# EAGLE design KCVGA 1.1 (EAGLE 7.2.0)
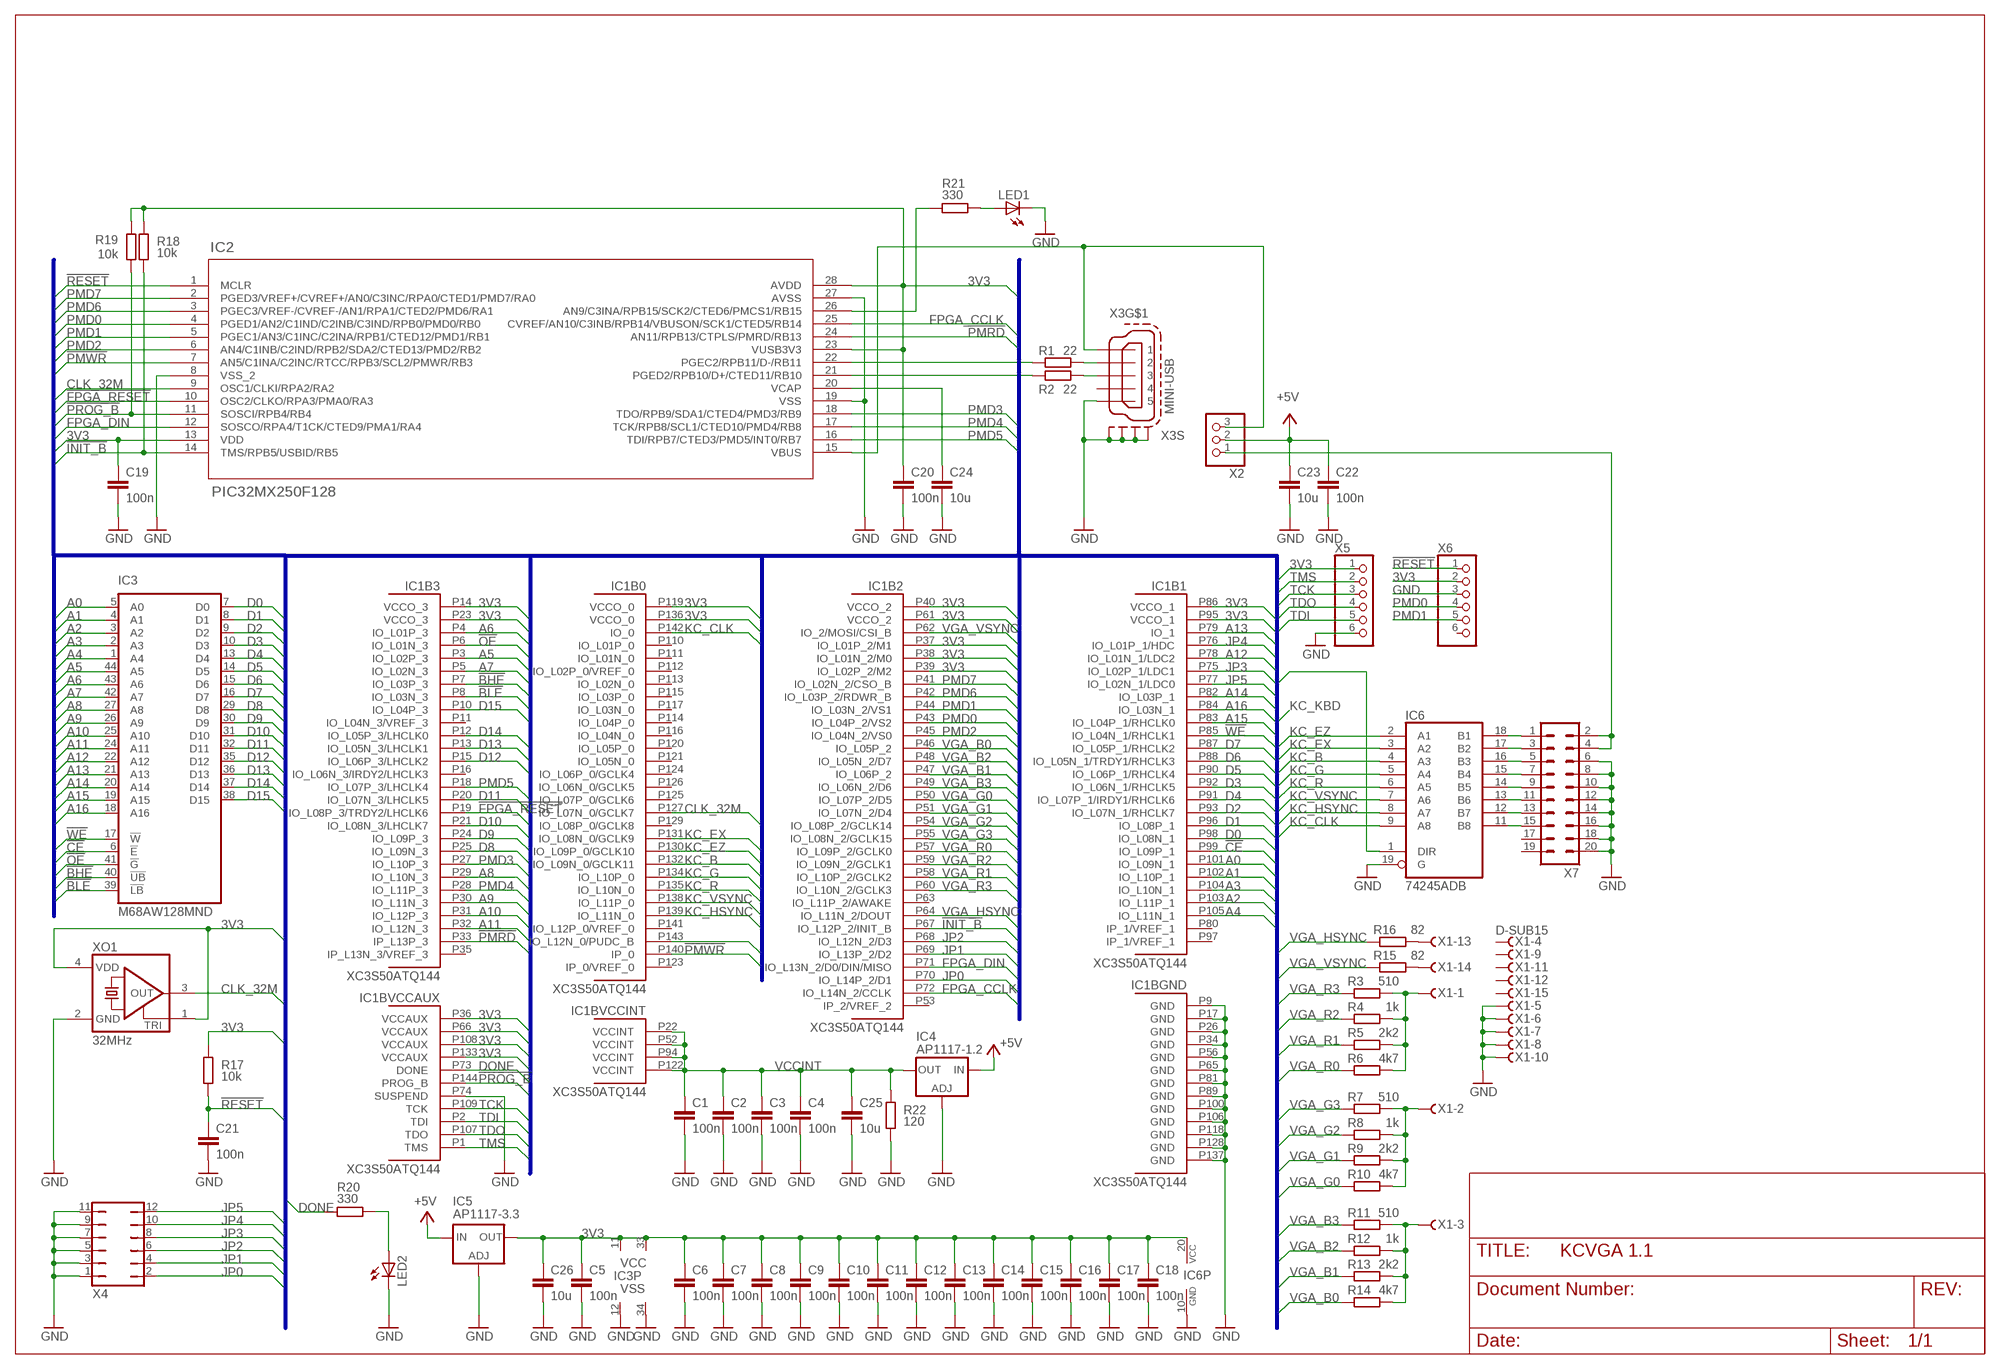
[diagram p0: schematic, sheet 1]

## Parts
C1  100n  C-EUC0603K  [C0603K]
C2  100n  C-EUC0603K  [C0603K]
C3  100n  C-EUC0603K  [C0603K]
C4  100n  C-EUC0603K  [C0603K]
C5  100n  C-EUC0603K  [C0603K]
C6  100n  C-EUC0603K  [C0603K]
C7  100n  C-EUC0603K  [C0603K]
C8  100n  C-EUC0603K  [C0603K]
C9  100n  C-EUC0603K  [C0603K]
C10  100n  C-EUC0603K  [C0603K]
C11  100n  C-EUC0603K  [C0603K]
C12  100n  C-EUC0603K  [C0603K]
C13  100n  C-EUC0603K  [C0603K]
C14  100n  C-EUC0603K  [C0603K]
C15  100n  C-EUC0603K  [C0603K]
C16  100n  C-EUC0603K  [C0603K]
C17  100n  C-EUC0603K  [C0603K]
C18  100n  C-EUC0603K  [C0603K]
C19  100n  C-EUC0603K  [C0603K]
C20  100n  C-EUC0603K  [C0603K]
C21  100n  C-EUC0603K  [C0603K]
C22  100n  C-EUC0603K  [C0603K]
C23  10u  C-EUC1206K  [C1206K]
C24  10u  C-EUC1206K  [C1206K]
C25  10u  C-EUC1206K  [C1206K]
C26  10u  C-EUC1206K  [C1206K]
IC1  XC3S50ATQ144  [TQ144]
IC2  PIC32MX250F128  PIC32MX250F128B_I_SS  [SSOP28_MC]
IC3  M68AW128MND  [TSOP44-II]
IC4  AP1117-1.2  LD117AS12TR  [SOT223]
IC5  AP1117-3.3  LD117AS33TR  [SOT223]
IC6  74245ADB  [SSOP20D8]
LED1  LEDCHIPLED_0603  [CHIPLED_0603]
LED2  LEDCHIPLED_0603  [CHIPLED_0603]
R1  22  R-EU_R0603  [R0603]
R2  22  R-EU_R0603  [R0603]
R3  510  R-EU_R0603  [R0603]
R4  1k  R-EU_R0603  [R0603]
R5  2k2  R-EU_R0603  [R0603]
R6  4k7  R-EU_R0603  [R0603]
R7  510  R-EU_R0603  [R0603]
R8  1k  R-EU_R0603  [R0603]
R9  2k2  R-EU_R0603  [R0603]
R10  4k7  R-EU_R0603  [R0603]
R11  510  R-EU_R0603  [R0603]
R12  1k  R-EU_R0603  [R0603]
R13  2k2  R-EU_R0603  [R0603]
R14  4k7  R-EU_R0603  [R0603]
R15  82  R-EU_R0603  [R0603]
R16  82  R-EU_R0603  [R0603]
R17  10k  R-EU_R0603  [R0603]
R18  10k  R-EU_R0603  [R0603]
R19  10k  R-EU_R0603  [R0603]
R20  330  R-EU_R0603  [R0603]
R21  330  R-EU_R0603  [R0603]
R22  120  R-EU_R0603  [R0603]
X1  D-SUB15  D-SUB15-HDR15RA  [HDR15RA]
X2  PINHD-1X3  [1X03]
X3  MINI-USB  MINI-USB-SCHIELD-32005-301  [32005-301]
X4  JP6Q  [JP6Q]
X5  PINHD-1X6  [1X06]
X6  PINHD-1X6  [1X06]
X7  ML20  [ML20]
XO1  32MHz  ASE  [ASE]

## Nets
3V3: C5.1 C6.1 C7.1 C8.1 C9.1 C10.1 C11.1 C12.1 C13.1 C14.1 C15.1 C16.1 C17.1 C18.1 C19.1 C20.1 C26.1 IC1.P14(B3:VCCO_3) IC1.P23(B3:VCCO_3) IC1.P36(BVCCAUX:VCCAUX) IC1.P37(B2:IO_L01P_2/M1) IC1.P38(B2:IO_L01N_2/M0) IC1.P39(B2:IO_L02P_2/M2) IC1.P40(B2:VCCO_2) IC1.P61(B2:VCCO_2) IC1.P66(BVCCAUX:VCCAUX) IC1.P86(B1:VCCO_1) IC1.P95(B1:VCCO_1) IC1.P108(BVCCAUX:VCCAUX) IC1.P119(B0:VCCO_0) IC1.P133(BVCCAUX:VCCAUX) IC1.P136(B0:VCCO_0) IC1.P143(B0:IO_L12N_0/PUDC_B) IC2.13(VDD) IC2.23(VUSB3V3) IC2.28(AVDD) IC3.11(VCC) IC3.33(VCC) IC5.4(OUT) IC6.1(DIR) IC6.20(VCC) R17.2 R18.2 R19.2 X5.1 X6.2 XO1.1(TRI) XO1.4(VDD)
!BHE: IC1.P7(B3:IO_L03P_3) IC3.40(!UB)
!BLE: IC1.P8(B3:IO_L03N_3) IC3.39(!LB)
!CE: IC1.P99(B1:IO_L09P_1) IC3.6(!E)
!FPGA_RESET: IC1.P19(B3:IO_L08P_3/TRDY2/LHCLK6) IC2.10(OSC2/CLKO/RPA3/PMA0/RA3)
!INIT_B: IC1.P67(B2:IO_L12P_2/INIT_B) IC2.14(TMS/RPB5/USBID/RB5) R18.1
!OE: IC1.P6(B3:IO_L01N_3) IC3.41(!G)
!PMRD: IC1.P33(B3:IP_L13P_3) IC2.24(AN11/RPB13/CTPLS/PMRD/RB13)
!PMWR: IC1.P140(B0:IP_0) IC2.7(AN5/C1INA/C2INC/RTCC/RPB3/SCL2/PMWR/RB3)
!PROG_B: IC1.P144(BVCCAUX:PROG_B) IC2.11(SOSCI/RPB4/RB4) R19.1
!RESET: C21.1 IC2.1(MCLR) R17.1 X6.1
!WE: IC1.P85(B1:IO_L04N_1/RHCLK1) IC3.17(!W)
+5V: C22.1 C23.1 IC4.3(IN) IC5.3(IN) X2.2
A0: IC1.P101(B1:IO_L09N_1) IC3.5(A0)
A1: IC1.P102(B1:IO_L10P_1) IC3.4(A1)
A2: IC1.P103(B1:IO_L11P_1) IC3.3(A2)
A3: IC1.P104(B1:IO_L10N_1) IC3.2(A3)
A4: IC1.P105(B1:IO_L11N_1) IC3.1(A4)
A5: IC1.P3(B3:IO_L02P_3) IC3.44(A5)
A6: IC1.P4(B3:IO_L01P_3) IC3.43(A6)
A7: IC1.P5(B3:IO_L02N_3) IC3.42(A7)
A8: IC1.P29(B3:IO_L10N_3) IC3.27(A8)
A9: IC1.P30(B3:IO_L11N_3) IC3.26(A9)
A10: IC1.P31(B3:IO_L12P_3) IC3.25(A10)
A11: IC1.P32(B3:IO_L12N_3) IC3.24(A11)
A12: IC1.P78(B1:IO_L01N_1/LDC2) IC3.22(A12)
A13: IC1.P79(B1:IO_1) IC3.21(A13)
A14: IC1.P82(B1:IO_L03P_1) IC3.20(A14)
A15: IC1.P83(B1:IO_L04P_1/RHCLK0) IC3.19(A15)
A16: IC1.P84(B1:IO_L03N_1) IC3.18(A16)
CLK_32M: IC1.P127(B0:IO_L07N_0/GCLK7) IC2.9(OSC1/CLKI/RPA2/RA2) XO1.3(OUT)
D0: IC1.P98(B1:IO_L08N_1) IC3.7(D0)
D1: IC1.P96(B1:IO_L08P_1) IC3.8(D1)
D2: IC1.P93(B1:IO_L07N_1/RHCLK7) IC3.9(D2)
D3: IC1.P92(B1:IO_L06N_1/RHCLK5) IC3.10(D3)
D4: IC1.P91(B1:IO_L07P_1/IRDY1/RHCLK6) IC3.13(D4)
D5: IC1.P90(B1:IO_L06P_1/RHCLK4) IC3.14(D5)
D6: IC1.P88(B1:IO_L05N_1/TRDY1/RHCLK3) IC3.15(D6)
D7: IC1.P87(B1:IO_L05P_1/RHCLK2) IC3.16(D7)
D8: IC1.P25(B3:IO_L09N_3) IC3.29(D8)
D9: IC1.P24(B3:IO_L09P_3) IC3.30(D9)
D10: IC1.P21(B3:IO_L08N_3/LHCLK7) IC3.31(D10)
D11: IC1.P20(B3:IO_L07N_3/LHCLK5) IC3.32(D11)
D12: IC1.P15(B3:IO_L06P_3/LHCLK2) IC3.35(D12)
D13: IC1.P13(B3:IO_L05N_3/LHCLK1) IC3.36(D13)
D14: IC1.P12(B3:IO_L05P_3/LHCLK0) IC3.37(D14)
D15: IC1.P10(B3:IO_L04P_3) IC3.38(D15)
DONE: IC1.P73(BVCCAUX:DONE) R20.1
FPGA_CCLK: IC1.P72(B2:IO_L14N_2/CCLK) IC2.25(CVREF/AN10/C3INB/RPB14/VBUSON/SCK1/CTED5/RB14)
FPGA_DIN: IC1.P71(B2:IO_L13N_2/D0/DIN/MISO) IC2.12(SOSCO/RPA4/T1CK/CTED9/PMA1/RA4)
GND: C1.2 C2.2 C3.2 C4.2 C5.2 C6.2 C7.2 C8.2 C9.2 C10.2 C11.2 C12.2 C13.2 C14.2 C15.2 C16.2 C17.2 C18.2 C19.2 C20.2 C21.2 C22.2 C23.2 C24.2 C25.2 C26.2 IC1.P9(BGND:GND) IC1.P17(BGND:GND) IC1.P26(BGND:GND) IC1.P34(BGND:GND) IC1.P56(BGND:GND) IC1.P65(BGND:GND) IC1.P74(BVCCAUX:SUSPEND) IC1.P81(BGND:GND) IC1.P89(BGND:GND) IC1.P100(BGND:GND) IC1.P106(BGND:GND) IC1.P118(BGND:GND) IC1.P128(BGND:GND) IC1.P137(BGND:GND) IC2.8(VSS_2) IC2.19(VSS) IC2.27(AVSS) IC3.12(VSS) IC3.34(VSS) IC4.1(ADJ) IC5.1(ADJ) IC6.10(GND) IC6.19(G) LED1.C LED2.C R22.1 X1.5 X1.6 X1.7 X1.8 X1.10 X3.5 X3.M1(S:S1) X3.M2(S:S2) X3.M3(S:S3) X3.M4(S:S4) X4.1 X4.3 X4.5 X4.7 X4.9 X4.11 X5.6 X6.3 X7.6 X7.8 X7.10 X7.12 X7.14 X7.16 X7.18 X7.20 XO1.2(GND)
JP0: IC1.P70(B2:IO_L14P_2/D1) X4.2
JP1: IC1.P69(B2:IO_L13P_2/D2) X4.4
JP2: IC1.P68(B2:IO_L12N_2/D3) X4.6
JP3: IC1.P75(B1:IO_L02P_1/LDC1) X4.8
JP4: IC1.P76(B1:IO_L01P_1/HDC) X4.10
JP5: IC1.P77(B1:IO_L02N_1/LDC0) X4.12
KC_B: IC1.P132(B0:IO_L09N_0/GCLK11) IC6.4(A3)
KC_CLK: IC1.P142(B0:IO_0) IC6.9(A8)
KC_EX: IC1.P131(B0:IO_L08N_0/GCLK9) IC6.3(A2)
KC_EZ: IC1.P130(B0:IO_L09P_0/GCLK10) IC6.2(A1)
KC_G: IC1.P134(B0:IO_L10P_0) IC6.5(A4)
KC_HSYNC: IC1.P139(B0:IO_L11N_0) IC6.8(A7)
KC_R: IC1.P135(B0:IO_L10N_0) IC6.6(A5)
KC_VSYNC: IC1.P138(B0:IO_L11P_0) IC6.7(A6)
N$1: IC2.15(VBUS) X2.3 X3.1
N$2: IC6.18(B1) X7.1
N$3: IC6.17(B2) X7.3
N$4: IC6.16(B3) X7.5
N$5: IC6.15(B4) X7.7
N$6: IC6.14(B5) X7.9
N$7: IC6.13(B6) X7.11
N$8: IC6.12(B7) X7.13
N$9: IC6.11(B8) X7.15
N$10: R16.2 X1.13
N$11: IC2.22(PGEC2/RPB11/D-/RB11) R1.1
N$12: IC2.21(PGED2/RPB10/D+/CTED11/RB10) R2.1
N$13: R1.2 X3.2
N$14: R2.2 X3.3
N$15: R15.2 X1.14
N$16: C24.1 IC2.20(VCAP)
N$17: R11.2 R12.2 R13.2 R14.2 X1.3
N$18: R7.2 R8.2 R9.2 R10.2 X1.2
N$19: R3.2 R4.2 R5.2 R6.2 X1.1
N$20: X2.1 X7.2 X7.4
N$21: LED2.A R20.2
N$22: IC2.26(AN9/C3INA/RPB15/SCK2/CTED6/PMCS1/RB15) R21.1
N$23: LED1.A R21.2
PMD0: IC1.P43(B2:IO_L04P_2/VS2) IC2.4(PGED1/AN2/C1IND/C2INB/C3IND/RPB0/PMD0/RB0) X6.4
PMD1: IC1.P44(B2:IO_L03N_2/VS1) IC2.5(PGEC1/AN3/C1INC/C2INA/RPB1/CTED12/PMD1/RB1) X6.5
PMD2: IC1.P45(B2:IO_L04N_2/VS0) IC2.6(AN4/C1INB/C2IND/RPB2/SDA2/CTED13/PMD2/RB2)
PMD3: IC1.P27(B3:IO_L10P_3) IC2.18(TDO/RPB9/SDA1/CTED4/PMD3/RB9)
PMD4: IC1.P28(B3:IO_L11P_3) IC2.17(TCK/RPB8/SCL1/CTED10/PMD4/RB8)
PMD5: IC1.P18(B3:IO_L07P_3/LHCLK4) IC2.16(TDI/RPB7/CTED3/PMD5/INT0/RB7)
PMD6: IC1.P42(B2:IO_L03P_2/RDWR_B) IC2.3(PGEC3/VREF-/CVREF-/AN1/RPA1/CTED2/PMD6/RA1)
PMD7: IC1.P41(B2:IO_L02N_2/CSO_B) IC2.2(PGED3/VREF+/CVREF+/AN0/C3INC/RPA0/CTED1/PMD7/RA0)
TCK: IC1.P109(BVCCAUX:TCK) X5.3
TDI: IC1.P2(BVCCAUX:TDI) X5.5
TDO: IC1.P107(BVCCAUX:TDO) X5.4
TMS: IC1.P1(BVCCAUX:TMS) X5.2
VCCINT: C1.1 C2.1 C3.1 C4.1 C25.1 IC1.P22(BVCCINT:VCCINT) IC1.P52(BVCCINT:VCCINT) IC1.P94(BVCCINT:VCCINT) IC1.P122(BVCCINT:VCCINT) IC4.4(OUT) R22.2
VGA_B0: IC1.P46(B2:IO_L05P_2) R14.1
VGA_B1: IC1.P47(B2:IO_L06P_2) R13.1
VGA_B2: IC1.P48(B2:IO_L05N_2/D7) R12.1
VGA_B3: IC1.P49(B2:IO_L06N_2/D6) R11.1
VGA_G0: IC1.P50(B2:IO_L07P_2/D5) R10.1
VGA_G1: IC1.P51(B2:IO_L07N_2/D4) R9.1
VGA_G2: IC1.P54(B2:IO_L08P_2/GCLK14) R8.1
VGA_G3: IC1.P55(B2:IO_L08N_2/GCLK15) R7.1
VGA_HSYNC: IC1.P64(B2:IO_L11N_2/DOUT) R16.1
VGA_R0: IC1.P57(B2:IO_L09P_2/GCLK0) R6.1
VGA_R1: IC1.P58(B2:IO_L10P_2/GCLK2) R5.1
VGA_R2: IC1.P59(B2:IO_L09N_2/GCLK1) R4.1
VGA_R3: IC1.P60(B2:IO_L10N_2/GCLK3) R3.1
VGA_VSYNC: IC1.P62(B2:IO_2/MOSI/CSI_B) R15.1
Unconnected: IC1.P11(B3:IO_L04N_3/VREF_3) IC1.P16(B3:IO_L06N_3/IRDY2/LHCLK3) IC1.P35(B3:IP_L13N_3/VREF_3) IC1.P53(B2:IP_2/VREF_2) IC1.P63(B2:IO_L11P_2/AWAKE) IC1.P80(B1:IP_1/VREF_1) IC1.P97(B1:IP_1/VREF_1) IC1.P110(B0:IO_L01P_0) IC1.P111(B0:IO_L01N_0) IC1.P112(B0:IO_L02P_0/VREF_0) IC1.P113(B0:IO_L02N_0) IC1.P114(B0:IO_L04P_0) IC1.P115(B0:IO_L03P_0) IC1.P116(B0:IO_L04N_0) IC1.P117(B0:IO_L03N_0) IC1.P120(B0:IO_L05P_0) IC1.P121(B0:IO_L05N_0) IC1.P123(B0:IP_0/VREF_0) IC1.P124(B0:IO_L06P_0/GCLK4) IC1.P125(B0:IO_L07P_0/GCLK6) IC1.P126(B0:IO_L06N_0/GCLK5) IC1.P129(B0:IO_L08P_0/GCLK8) IC1.P141(B0:IO_L12P_0/VREF_0) X1.4 X1.9 X1.11 X1.12 X1.15 X3.4 X6.6 X7.17 X7.19

## Buses
BUS:3V3,!WE,!CE,!OE,!BLE,!BHE,A[0..16],D[0..15],KC_CLK,KC_VSYNC,KC_HSYNC,KC_R,KC_G,KC_B,KC_EX,KC_EY,KC_EZ,VGA_HSYNC,VGA_VSYNC,VGA_R[0..3],VGA_G[0..3],VGA_B[0..3],PMD[0..7],PMA[0..1],!PMRD,!PMWR,TMS,TCK,TDO,TDI,CLK_32M,FPGA_CLK,!RESET,FPGA_CCLK,FPGA_DIN,!INIT_B,!PROG_B,DONE,!FPGA_RESET,JP[0..5]

## Library data of the parts
C1-C26 = rcl:C-EU: CAPACITOR, European symbol
IC1 = xilinx_devices_V6:XC3S50ATQ144: Xilinx FPGA: XC3S50ATQ144
IC2 = PIC32MX270:PIC32MX250F128B_I_SS
IC3 = st-microelectronics:M68AW128M: 2 Mbit (128K x16) 3.0V Asynchronous SRAM Source: Source: http://us.st.com/stonline/products/literature/ds/7995.pdf; OC_FARNELL: unknown; OC_NEWARK: unknown
IC4 IC5 = v-reg:LD117A?*: Low drop fixed and adjustable positive voltage regulators 1 A Source: http://www.st.com/stonline/products/literature/ds/7194/ld1117axx.pdf
IC6 = 74xx-eu:74*245: Octal BUS TRANSCEIVER, 3-state
LED1 LED2 = led:LED: LED OSRAM: - CHIPLED LG R971, LG N971, LY N971, LG Q971, LY Q971, LO R971, LY R971 LH N974, LH R974 LS Q976, LO Q976, LY Q976 LO Q996 - Hyper CHIPLED LW Q18S LB Q993, LB Q99A, LB R99A - SideLED LS A670, LO A670, LY A670, LG A670, LP A670 LB A673, LV A673, LT A673, LW A673 LH A674 LY A675 LS A676, LA A676, LO A676, LY A676, LW A676 LS A679, LY A679, LG A679 - Hyper Micro SIDELED® LS Y876, LA Y876, LO Y876, LY Y876 LT Y87S - SmartLED LW L88C, LW L88S LB L89C, LB L89S, LG L890 LS L89K, LO L89K, LY L89K LS L896, LA L896, LO L896, LY L896 - TOPLED LS T670, LO T670, LY T670, LG T670, LP T670 LSG T670, LSP T670, LSY T670, LOP T670, LYG T670 LG T671, LOG T671, LSG T671 LB T673, LV T673, LT T673, LW T673 LH T674 LS T676, LA T676, LO T676, LY T676, LB T676, LH T676, LSB T676, LW T676 LB T67C, LV T67C, LT T67C, LS T67K, LO T67K, LY T67K, LW E67C LS E67B, LA E67B, LO E67B, LY E67B, LB E67C, LV E67C, LT E67C LW T67C LS T679, LY T679, LG T679 LS T770, LO T770, LY T770, LG T770, LP T770 LB T773, LV T773, LT T773, LW T773 LH T774 LS E675, LA E675, LY E675, LS T675 LS T776, LA T776, LO T776, LY T776, LB T776 LHGB T686 LT T68C, LB T68C - Hyper Mini TOPLED® LB M676 - Mini TOPLED Santana® LG M470 LS M47K, LO M47K, LY M47K Source: http://www.osram.convergy.de LUXEON: - LUMILED® LXK2-PW12-R00, LXK2-PW12-S00, LXK2-PW14-U00, LXK2-PW14-V00 LXK2-PM12-R00, LXK2-PM12-S00, LXK2-PM14-U00 LXK2-PE12-Q00, LXK2-PE12-R00, LXK2-PE12-S00, LXK2-PE14-T00, LXK2-PE14-U00 LXK2-PB12-K00, LXK2-PB12-L00, LXK2-PB12-M00, LXK2-PB14-N00, LXK2-PB14-P00, LXK2-PB14-Q00 LXK2-PR12-L00, LXK2-PR12-M00, LXK2-PR14-Q00, LXK2-PR14-R00 LXK2-PD12-Q00, LXK2-PD12-R00, LXK2-PD12-S00 LXK2-PH12-R00, LXK2-PH12-S00 LXK2-PL12-P00, LXK2-PL12-Q00, LXK2-PL12-R00 Source: www.luxeon.com KINGBRIGHT: KA-3528ASYC Source: www.kingbright.com
R1-R22 = rcl:R-EU_: RESISTOR, European symbol
X1 = con-thomas-betts:D-SUB15-: D-Subminiatur Connector Source: Electronioc Interconnects European Edition 1998; OC_FARNELL: unknown; OC_NEWARK: unknown
X2 = pinhead:PINHD-1X3: PIN HEADER
X3 = con-cypressindustries:MINI-USB-SCHIELD-: MINI USB-B Conector Source: www.cypressindustries.com; OC_FARNELL: unknown; OC_NEWARK: unknown
X4 = jumper:JP6Q: JUMPER
X5 X6 = pinhead:PINHD-1X6: PIN HEADER
X7 = con-ml:ML20: HARTING; OC_FARNELL: unknown; OC_NEWARK: unknown
XO1 = crystal:ASE: 3.3Vdc CMOS SMD CRYSTAL CLOCK OSCILLATOR SOurce: www.abracon.com; OC_FARNELL: unknown; OC_NEWARK: unknown; RS: 671-9750

## Board
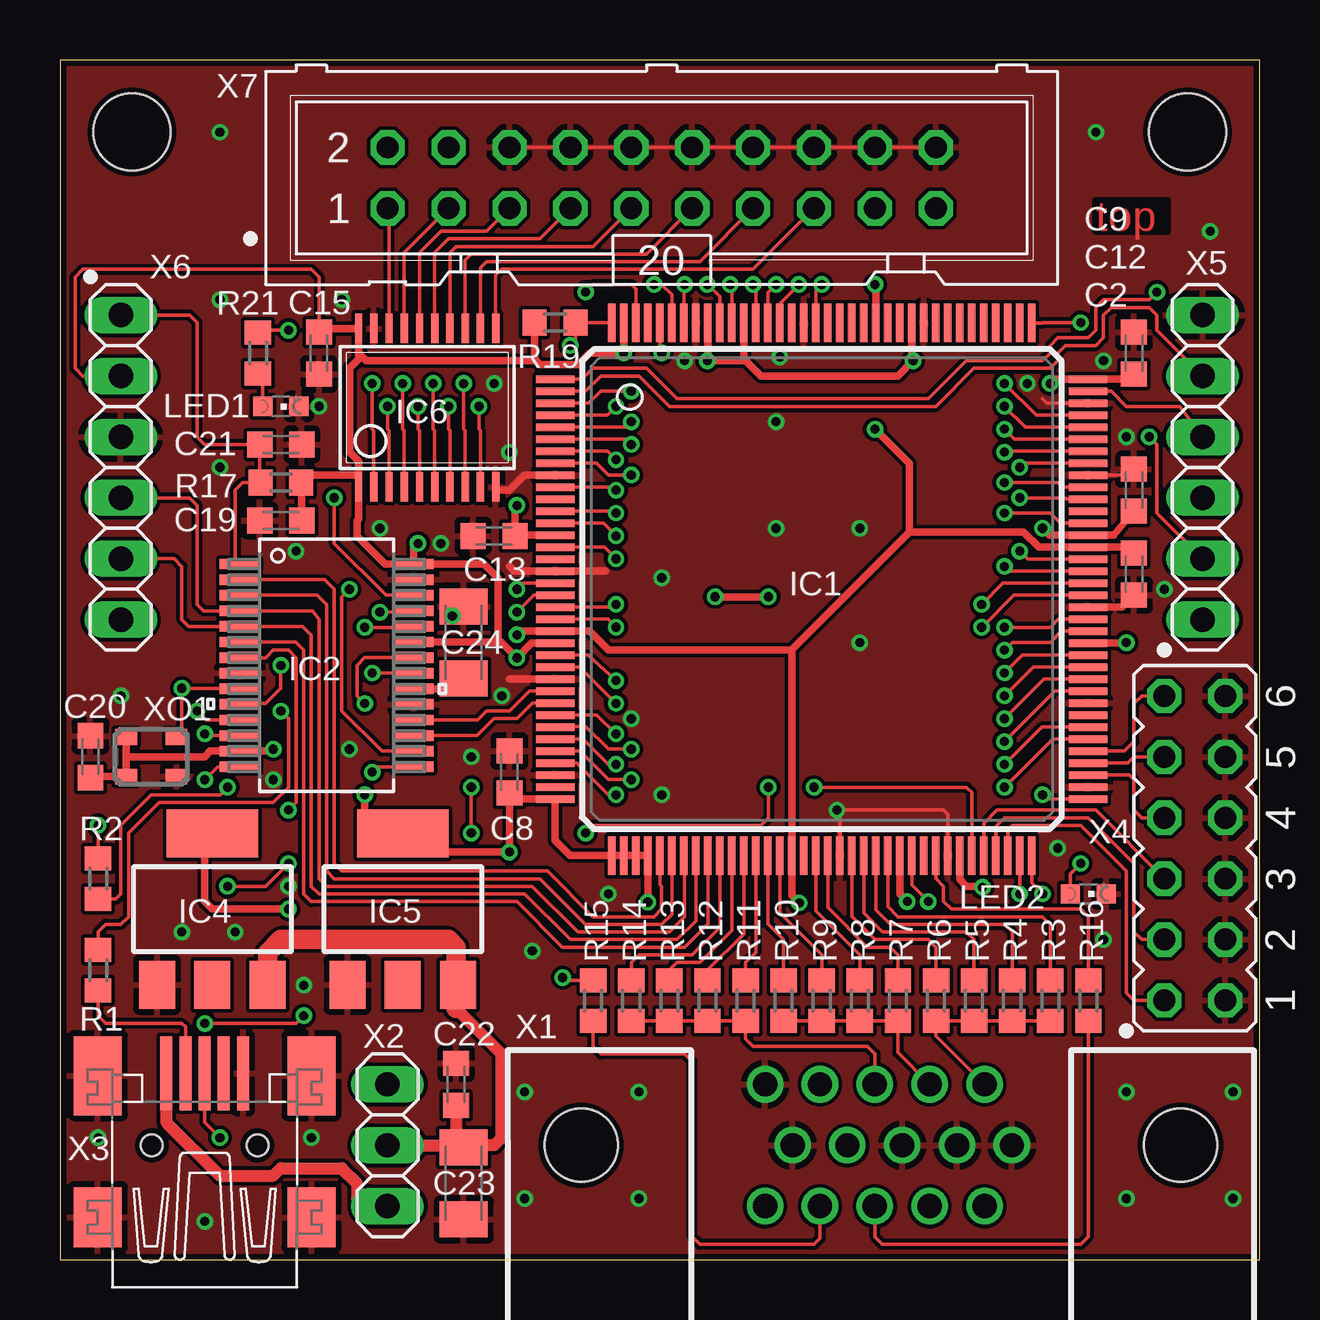
[diagram p1: board, top side]
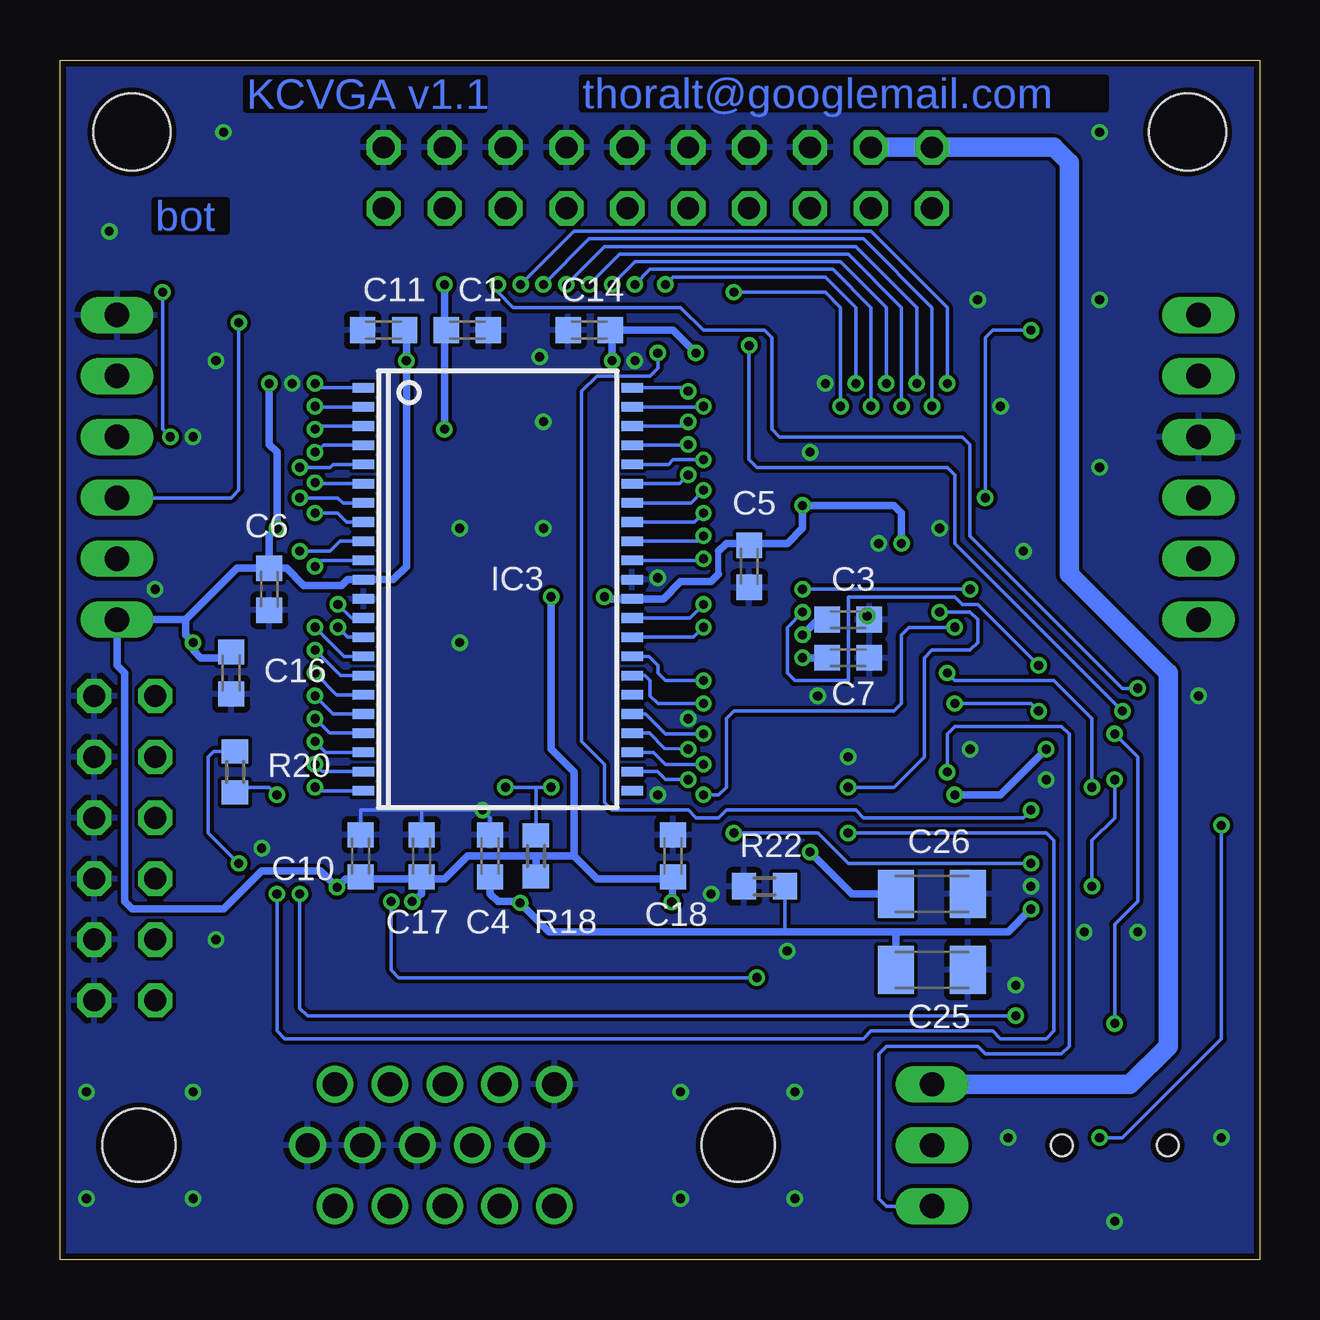
[diagram p2: board, bottom side, seen from below]

Size 50 x 50 mm. Coordinates in mm from the lower left corner, seen from the top.
Outline: 0,0 50,0 50,50 0,50 0,0
Copper layers (1*16): Top 0.035mm / dielectric 1.5mm / Bottom 0.035mm
Design rules "SeeedStudio_2layer_DRU_no_angle_20140221": minimum track width 6mil, minimum drill 12mil, track to track 6mil, track to pad 6mil, pad to pad 6mil, via to via 6mil, smd to smd 0mil, copper to edge 10mil, drill to drill 10mil, minimum pad ring 10mil, minimum via ring 6mil, stop-mask expansion 2mil, vias tented up to drill 100mil, thermal gap 10mil
Holes 3.2 mm at 3,47 47,47

### Footprints (pad centres in the part's own frame; a part is rotated, then mirrored left to right if it is on the bottom)
C0603K = smd 1.05 x 1.08: 1 -0.875,0; 2 0.875,0
C1206K = smd 1.5 x 2: 1 -1.5,0; 2 1.5,0
TQ144 = smd 1.6 x 0.3: P1 -11.1,8.75; P2 -11.1,8.25; P3 -11.1,7.75; P4 -11.1,7.25; P5 -11.1,6.75; P6 -11.1,6.25; P7 -11.1,5.75; P8 -11.1,5.25; P9 -11.1,4.75; P10 -11.1,4.25; P11 -11.1,3.75; P12 -11.1,3.25; P13 -11.1,2.75; P14 -11.1,2.25; P15 -11.1,1.75; P16 -11.1,1.25; P17 -11.1,0.75; P18 -11.1,0.25; P19 -11.1,-0.25; P20 -11.1,-0.75; P21 -11.1,-1.25; P22 -11.1,-1.75; P23 -11.1,-2.25; P24 -11.1,-2.75; P25 -11.1,-3.25; P26 -11.1,-3.75; P27 -11.1,-4.25; P28 -11.1,-4.75; P29 -11.1,-5.25; P30 -11.1,-5.75; P31 -11.1,-6.25; P32 -11.1,-6.75; P33 -11.1,-7.25; P34 -11.1,-7.75; P35 -11.1,-8.25; P36 -11.1,-8.75; P73 11.1,-8.75; P74 11.1,-8.25; P75 11.1,-7.75; P76 11.1,-7.25; P77 11.1,-6.75; P78 11.1,-6.25; P79 11.1,-5.75; P80 11.1,-5.25; P81 11.1,-4.75; P82 11.1,-4.25; P83 11.1,-3.75; P84 11.1,-3.25; P85 11.1,-2.75; P86 11.1,-2.25; P87 11.1,-1.75; P88 11.1,-1.25; P89 11.1,-0.75; P90 11.1,-0.25; P91 11.1,0.25; P92 11.1,0.75; P93 11.1,1.25; P94 11.1,1.75; P95 11.1,2.25; P96 11.1,2.75; P97 11.1,3.25; P98 11.1,3.75; P99 11.1,4.25; P100 11.1,4.75; P101 11.1,5.25; P102 11.1,5.75; P103 11.1,6.25; P104 11.1,6.75; P105 11.1,7.25; P106 11.1,7.75; P107 11.1,8.25; P108 11.1,8.75 | smd 0.3 x 1.6: P37 -8.75,-11.1; P38 -8.25,-11.1; P39 -7.75,-11.1; P40 -7.25,-11.1; P41 -6.75,-11.1; P42 -6.25,-11.1; P43 -5.75,-11.1; P44 -5.25,-11.1; P45 -4.75,-11.1; P46 -4.25,-11.1; P47 -3.75,-11.1; P48 -3.25,-11.1; P49 -2.75,-11.1; P50 -2.25,-11.1; P51 -1.75,-11.1; P52 -1.25,-11.1; P53 -0.75,-11.1; P54 -0.25,-11.1; P55 0.25,-11.1; P56 0.75,-11.1; P57 1.25,-11.1; P58 1.75,-11.1; P59 2.25,-11.1; P60 2.75,-11.1; P61 3.25,-11.1; P62 3.75,-11.1; P63 4.25,-11.1; P64 4.75,-11.1; P65 5.25,-11.1; P66 5.75,-11.1; P67 6.25,-11.1; P68 6.75,-11.1; P69 7.25,-11.1; P70 7.75,-11.1; P71 8.25,-11.1; P72 8.75,-11.1; P109 8.75,11.1; P110 8.25,11.1; P111 7.75,11.1; P112 7.25,11.1; P113 6.75,11.1; P114 6.25,11.1; P115 5.75,11.1; P116 5.25,11.1; P117 4.75,11.1; P118 4.25,11.1; P119 3.75,11.1; P120 3.25,11.1; P121 2.75,11.1; P122 2.25,11.1; P123 1.75,11.1; P124 1.25,11.1; P125 0.75,11.1; P126 0.25,11.1; P127 -0.25,11.1; P128 -0.75,11.1; P129 -1.25,11.1; P130 -1.75,11.1; P131 -2.25,11.1; P132 -2.75,11.1; P133 -3.25,11.1; P134 -3.75,11.1; P135 -4.25,11.1; P136 -4.75,11.1; P137 -5.25,11.1; P138 -5.75,11.1; P139 -6.25,11.1; P140 -6.75,11.1; P141 -7.25,11.1; P142 -7.75,11.1; P143 -8.25,11.1; P144 -8.75,11.1
SSOP28_MC = smd 1.676 x 0.432: 1 -3.617,4.225; 2 -3.617,3.575; 3 -3.617,2.925; 4 -3.617,2.275; 5 -3.617,1.625; 6 -3.617,0.975; 7 -3.617,0.325; 8 -3.617,-0.325; 9 -3.617,-0.975; 10 -3.617,-1.625; 11 -3.617,-2.275; 12 -3.617,-2.925; 13 -3.617,-3.575; 14 -3.617,-4.225; 15 3.617,-4.225; 16 3.617,-3.575; 17 3.617,-2.925; 18 3.617,-2.275; 19 3.617,-1.625; 20 3.617,-0.975; 21 3.617,-0.325; 22 3.617,0.325; 23 3.617,0.975; 24 3.617,1.625; 25 3.617,2.275; 26 3.617,2.925; 27 3.617,3.575; 28 3.617,4.225
TSOP44-II = smd 0.4 x 0.9: 1 -8.4,-5.6; 2 -7.6,-5.6; 3 -6.8,-5.6; 4 -6,-5.6; 5 -5.2,-5.6; 6 -4.4,-5.6; 7 -3.6,-5.6; 8 -2.8,-5.6; 9 -2,-5.6; 10 -1.2,-5.6; 11 -0.4,-5.6; 12 0.4,-5.6; 13 1.2,-5.6; 14 2,-5.6; 15 2.8,-5.6; 16 3.6,-5.6; 17 4.4,-5.6; 18 5.2,-5.6; 19 6,-5.6; 20 6.8,-5.6; 21 7.6,-5.6; 22 8.4,-5.6; 23 8.4,5.6; 24 7.6,5.6; 25 6.8,5.6; 26 6,5.6; 27 5.2,5.6; 28 4.4,5.6; 29 3.6,5.6; 30 2.8,5.6; 31 2,5.6; 32 1.2,5.6; 33 0.4,5.6; 34 -0.4,5.6; 35 -1.2,5.6; 36 -2,5.6; 37 -2.8,5.6; 38 -3.6,5.6; 39 -4.4,5.6; 40 -5.2,5.6; 41 -6,5.6; 42 -6.8,5.6; 43 -7.6,5.6; 44 -8.4,5.6
SOT223 = smd 1.5 x 2: 1 -2.3,-3.15; 2 0,-3.15; 3 2.3,-3.15 | smd 3.8 x 2: 4 0,3.15
SSOP20D8 = smd 0.305 x 1.245: 1 -2.794,-3.353; 2 -2.159,-3.353; 3 -1.524,-3.353; 4 -0.889,-3.353; 5 -0.254,-3.353; 6 0.381,-3.353; 7 1.016,-3.353; 8 1.651,-3.353; 9 2.286,-3.353; 10 2.921,-3.353; 11 2.921,3.251; 12 2.286,3.251; 13 1.651,3.251; 14 1.016,3.251; 15 0.381,3.251; 16 -0.254,3.251; 17 -0.889,3.251; 18 -1.524,3.251; 19 -2.159,3.251; 20 -2.794,3.251
CHIPLED_0603 = smd 0.8 x 0.8: A 0,-0.75; C 0,0.75
R0603 = smd 1 x 1.1: 1 -0.85,0; 2 0.85,0
HDR15RA = drill 1.016: 1 4.318,2.54; 2 2.032,2.54; 3 -0.254,2.54; 4 -2.54,2.54; 5 -4.826,2.54; 6 5.461,0; 7 3.175,0; 8 0.889,0; 9 -1.397,0; 10 -3.683,0; 11 4.318,-2.54; 12 2.032,-2.54; 13 -0.254,-2.54; 14 -2.54,-2.54; 15 -4.826,-2.54 | hole 3.048: -12.497,0; 12.497,0
1X03 = drill 1.016 long: 1 -2.54,0; 2 0,0; 3 2.54,0
32005-301 = smd 3.1 x 0.5: 1 3,1.6; 2 3,0.8; 3 3,0; 4 3,-0.8; 5 3,-1.6 | smd 2.5 x 2: M1 -3,-4.45; M2 -3,4.45 | smd 3.3 x 2: M3 2.9,4.45; M4 2.9,-4.45 | hole 0.9: 0,2.2; 0,-2.2
JP6Q = drill 0.914 octagon: 1 -6.35,-1.27; 2 -6.35,1.27; 3 -3.81,-1.27; 4 -3.81,1.27; 5 -1.27,-1.27; 6 -1.27,1.27; 7 1.27,-1.27; 8 1.27,1.27; 9 3.81,-1.27; 10 3.81,1.27; 11 6.35,-1.27; 12 6.35,1.27
1X06 = drill 1.016 long: 1 -6.35,0; 2 -3.81,0; 3 -1.27,0; 4 1.27,0; 5 3.81,0; 6 6.35,0
ML20 = drill 0.914 octagon: 1 -11.43,-1.27; 2 -11.43,1.27; 3 -8.89,-1.27; 4 -8.89,1.27; 5 -6.35,-1.27; 6 -6.35,1.27; 7 -3.81,-1.27; 8 -3.81,1.27; 9 -1.27,-1.27; 10 -1.27,1.27; 11 1.27,-1.27; 12 1.27,1.27; 13 3.81,-1.27; 14 3.81,1.27; 15 6.35,-1.27; 16 6.35,1.27; 17 8.89,-1.27; 18 8.89,1.27; 19 11.43,-1.27; 20 11.43,1.27
ASE = smd 0.9 x 0.65: 1 -1.05,-0.825; 2 1.05,-0.825; 3 1.05,0.825; 4 -1.05,0.825

### Placement (x,y rotation side)
C1  33.02,38.73 0 bottom
C2  44.77,28.57 270 top
C3  17.14,26.67 0 bottom
C4  32.07,16.83 90 bottom
C5  21.27,28.89 270 bottom
C6  41.27,27.94 270 bottom
C7  17.14,25.08 0 bottom
C8  18.73,20.32 90 top
C9  44.77,37.78 90 top
C10  37.47,16.83 90 bottom
C11  36.51,38.73 180 bottom
C12  44.77,32.07 90 top
C13  18.1,30.16 180 top
C14  27.94,38.73 180 bottom
C15  10.79,37.78 270 top
C16  42.86,24.45 270 bottom
C17  34.92,16.83 90 bottom
C18  24.45,16.83 90 bottom
C19  9.21,30.8 180 top
C20  1.27,20.95 90 top
C21  9.21,33.97 0 top
C22  16.51,7.3 90 top
C23  16.83,3.17 270 top
C24  16.83,25.72 90 top
C25  13.65,12.06 0 bottom
C26  13.65,15.24 0 bottom
IC1  31.75,27.94 0 top
IC2  11.11,24.77 0 top
IC3  31.75,27.94 270 bottom
IC4  6.35,14.61 0 top
IC5  14.29,14.61 0 top
IC6  15.24,35.56 0 top
LED1  9.21,35.56 270 top
LED2  42.86,15.24 270 top
R1  1.59,12.06 270 top
R2  1.59,15.88 90 top
R3  41.27,10.79 270 top
R4  39.69,10.79 270 top
R5  38.1,10.79 270 top
R6  36.51,10.79 270 top
R7  34.92,10.79 270 top
R8  33.34,10.79 270 top
R9  31.75,10.79 270 top
R10  30.16,10.79 270 top
R11  28.57,10.79 270 top
R12  26.99,10.79 270 top
R13  25.4,10.79 270 top
R14  23.81,10.79 270 top
R15  22.23,10.79 270 top
R16  42.86,10.79 270 top
R17  9.21,32.38 0 top
R18  30.16,16.83 270 bottom
R19  20.64,39.05 180 top
R20  42.7,20.32 90 bottom
R21  8.26,37.78 270 top
R22  20.64,15.56 0 bottom
X1  34.22,4.76 0 top
X2  13.65,4.76 270 top
X3  6.03,4.76 90 top
X4  47.31,17.14 90 top
X5  47.62,33.02 90 top
X6  2.54,33.02 270 top
X7  25.08,45.09 0 top
XO1  3.81,20.95 0 top

### Tracks (layer width: path | path; a pad name or v marks a point on that pad's centre or on a via)
3V3  (via drill 0.38)
  Top 0.152: v27,37.48 v26.99,37.47 | 35.5,37.52 v35.56,37.47 | 44.7,36.69 C9.1 | 38.42,15.56 v38.45,15.52 | 18.99,19.19 C8.1 | 19,30.19 C13.1 | 2.76,20.86 2.86,20.95 | 1.32,20.13 C20.1 | 20.64,19.18 IC1.P36 | X6.2 0.95,36.83 0.64,37.15 0.64,40.96 0.95,41.27 10.48,41.27 10.79,40.96 C15.1
  Top 0.305: IC1.P136 v27,37.48 | IC1.P119 35.5,37.52 | 44.7,36.69 IC1.P108 41.45,36.69 v41.27,36.51 | C12.1 43.92,30.19 IC1.P95 41.25,30.19 v40.96,30.48 | IC1.P66 37.5,15.84 37.78,15.56 38.42,15.56 | v24.5,14.9 IC1.P40 IC1.P39 IC1.P38 IC1.P37 21.26,16.84 20.64,17.46 20.64,19.18 | IC1.P36 18.99,19.19 | IC1.P14 19,30.19 | IC1.P61 35,15.24 v35.32,14.92 | XO1.4 2.76,20.86 XO1.1 1.32,20.13 | 2.86,20.95 6.03,20.95 6.27,21.19 IC2.13 8.81,21.19 v8.89,21.27 | IC2.28 13.55,28.99 12.38,30.16 12.38,30.8 12.45,30.86 IC6.1 12.45,32.7 | 19.05,30.09 C13.1 18.97,31.36 v19.05,31.43 | IC2.28 14.73,29.65 v14.92,29.84 | 10.72,38.73 C15.1 10.95,38.81 IC6.20 12.45,37.78 | R17.2 10.08,32.36 C19.1 10.08,32.62 10.16,32.7 12.45,32.7 | IC1.P23 19.66,25.69 v19.05,25.08 18.39,25.74 18.26,25.74 | 12.45,32.7 12.45,33.27 12.06,33.66 12.06,37.15 12.45,37.53 12.45,37.78 | v26.99,37.47 28.57,37.47 | 28.57,37.47 29.21,36.83 34.92,36.83 v35.56,37.47 | IC1.P133 28.5,37.54 28.57,37.47 | 19.84,37.47 20,37.31 21.59,37.31 22.07,37.78 v23.5,37.78 v23.5,37.79 IC1.P143 | R19.2 19.79,37.57 19.84,37.47 | 19.84,37.47 12.76,37.47 12.45,37.78 | C8.1 v18.73,16.99 15.06,16.99 IC5.4 12.72,17.75 12.7,17.78 v12.7,19.37 | IC2.23 18.26,25.74 | IC2.28 17.68,28.99 18.26,28.42 18.26,25.74 | v29.53,27.62 v27.3,27.62 | IC1.P86 44.42,25.69 v44.45,25.72
  Bottom 0.152: 26.99,38.49 C14.1 | 35.56,38.66 C11.1 | 35,15.88 C17.1
  Bottom 0.254: 22.54,28.57 22.54,29.53
  Bottom 0.305: v26.99,37.47 26.99,38.49 | 35.56,38.66 v35.56,37.47 35.56,28.89 36.11,28.34 IC3.11 38.02,28.34 38.26,28.1 39.85,28.1 40.56,28.82 C6.1 | v35.32,14.92 34.92,15.24 C17.1 34.61,15.88 33.97,15.88 33.02,16.83 30.16,16.83 | 37.47,15.88 C10.1 | v24.5,14.9 C18.1 24.45,15.88 27.62,15.88 28.57,16.83 | v14.92,29.84 14.92,31.11 15.24,31.43 v19.05,31.43 19.05,30.48 19.68,29.84 21.2,29.84 C5.1 21.35,29.84 22.23,29.84 22.54,29.53 | v19.05,25.08 C7.1 | 37.47,15.88 35,15.88 | IC3.33 24.85,27.54 24.13,28.26 22.86,28.26 22.54,28.57 | C6.1 42.62,28.82 44.77,26.67 | C6.1 41.27,30.16 v40.96,30.48 40.96,33.66 41.27,33.97 v41.27,36.51 | v23.5,37.78 24.45,38.73 C14.1 | 37.47,15.88 38.09,15.88 v38.45,15.52 39.13,16.19 41.59,16.19 43.18,14.61 46.99,14.61 47.31,14.92 47.31,24.45 47.62,24.77 X5.1 44.77,26.67 | 28.57,16.83 30.16,16.83 | v29.53,27.62 29.53,21.27 28.57,20.32 28.57,16.83 | v27.3,27.62 27.03,27.53 26.3,27.54 | v12.7,19.37 10.79,19.37 v8.89,21.27 | C26.1 16.99,15.24 v18.73,16.99 | R18.2 30.16,16.83 | C16.1 43.1,25.08 44.13,25.08 44.45,25.4 v44.45,25.72 44.77,26.04 44.77,26.67
!BHE  (via drill 0.38)
  Top 0.152: IC1.P7 22.82,33.69 v23.18,33.34
  Bottom 0.152: v23.18,33.34 24.45,33.34 24.64,33.14 IC3.40
!BLE  (via drill 0.38)
  Top 0.152: IC1.P8 22.37,33.19 22.86,32.7 v23.81,32.7
  Bottom 0.152: v23.81,32.7 24.18,32.34 IC3.39
!CE  (via drill 0.38)
  Top 0.152: IC1.P99 41.79,32.19 41.59,32.38 v39.37,32.38
  Bottom 0.152: IC3.6 39.33,32.34 v39.37,32.38
!FPGA_RESET  (via drill 0.38)
  Top 0.152: IC1.P19 19.75,27.69 v19.05,26.99 | v9.21,24.77 9.21,23.81 8.57,23.18 7.53,23.18 IC2.10
  Bottom 0.152: v9.21,24.77 11.75,27.3 12.38,27.3 12.7,27.62 17.14,27.62 17.14,24.13 19.37,24.13 19.68,24.45 19.68,26.35 v19.05,26.99
!INIT_B  (via drill 0.38)
  Top 0.152: IC1.P67 38,19.47 37.78,19.68 v31.43,19.68 | v29.53,19.68 29.53,18.41 29.21,18.1 22.23,18.1 v21.91,17.78 | v9.53,16.51 8.57,15.56 v6.99,15.56 | IC2.14 6.57,20.54 v6.03,20
  Bottom 0.152: v31.43,19.68 30.16,19.68 | 30.16,19.68 v29.53,19.68 | v21.91,17.78 18.41,17.78 17.14,16.51 v9.53,16.51 | v6.99,15.56 6.99,17.46 6.03,18.41 v6.03,20 | R18.1 30.16,19.68
!OE  (via drill 0.38)
  Top 0.152: IC1.P6 23.59,34.19 v23.81,33.97
  Bottom 0.152: IC3.41 24.16,33.94 v23.81,33.97
!PMRD  (via drill 0.38)
  Top 0.152: IC1.P33 21.54,20.69 22.86,19.37 v23.18,19.37 | v12.7,26.35 14.69,26.35 IC2.24
  Bottom 0.152: v23.18,19.37 22.54,19.37 22.23,19.68 22.23,22.54 21.91,22.86 15.24,22.86 14.92,23.18 14.92,26.04 14.61,26.35 v12.7,26.35
!PMWR  (via drill 0.38)
  Top 0.152: IC1.P140 25,37.87 v25.08,37.78 | v9.53,18.73 9.84,19.05 9.84,25.08 9.53,25.4 8.89,25.4 8.57,25.08 IC2.7
  Bottom 0.152: v25.08,37.78 25.08,37.15 25.4,36.83 27.62,36.83 28.26,36.2 28.26,21.59 27.3,20.64 27.3,19.05 26.99,18.73 23.81,18.73 23.5,18.41 22.54,18.41 22.23,18.73 16.83,18.73 16.51,18.41 9.84,18.41 v9.53,18.73
!PROG_B  (via drill 0.38)
  Top 0.152: IC1.P144 22.99,39.05 R19.1 21.49,38.31 v21.27,38.1 | IC2.11 6.08,22.49 v5.71,22.86
  Bottom 0.152: v5.71,22.86 12.7,29.84 12.7,32.7 13.02,33.02 20.95,33.02 21.27,33.34 v21.27,38.1
!RESET
  Top 0.152: IC2.1 7.3,29.18 7.3,32.07 7.62,32.38 R17.1 8.33,32.41 C21.1 6.03,33.97 5.71,34.29 5.71,39.05 5.4,39.37 X6.1
!WE  (via drill 0.38)
  Top 0.152: IC1.P85 40.11,25.19 v39.37,24.45
  Bottom 0.152: IC3.17 38.46,23.54 v39.37,24.45
+5V
  Top 0.152: 16.51,4.99 C23.1 16.91,4.76
  Top 0.508: X2.2 16.91,4.76 18.1,4.76 18.41,5.08 18.41,8.57 16.51,10.48 | C22.1 16.51,4.99
  Top 0.813: 16.51,10.48 16.51,11.38 | 16.51,11.38 IC5.3 | 16.51,11.38 16.51,13.02 16.19,13.34 9.21,13.34 8.65,12.78 IC4.3
A0  (via drill 0.38)
  Top 0.152: IC1.P101 40.17,33.19 v40.01,33.02
  Bottom 0.152: IC3.5 38.3,33.14 38.62,33.14 38.73,33.02 v40.01,33.02
A1  (via drill 0.38)
  Top 0.152: IC1.P102 39.34,33.69 v39.37,33.66
  Bottom 0.152: IC3.4 39.02,33.94 v39.37,33.66
A2  (via drill 0.38)
  Top 0.152: IC1.P103 39.79,34.19 v39.37,34.61
  Bottom 0.152: IC3.3 39.24,34.74 v39.37,34.61
A3  (via drill 0.38)
  Top 0.152: v39.37,35.56 40.24,34.69 IC1.P104
  Bottom 0.152: IC3.2 39.03,35.54 v39.37,35.56
A4  (via drill 0.38)
  Top 0.152: v39.37,36.51 40.69,35.19 IC1.P105
  Bottom 0.152: IC3.1 39.23,36.34 v39.37,36.51
A5  (via drill 0.38)
  Top 0.152: IC1.P3 22.04,35.69 22.54,36.2 v23.81,36.2
  Bottom 0.152: IC3.44 23.96,36.34 v23.81,36.2
A6  (via drill 0.38)
  Top 0.152: IC1.P4 22.81,35.19 22.86,35.24 v23.18,35.56
  Bottom 0.152: IC3.43 23.2,35.54 v23.18,35.56
A7  (via drill 0.38)
  Top 0.152: IC1.P5 23.58,34.69 v23.81,34.92
  Bottom 0.152: IC3.42 23.95,34.74 v23.81,34.92
A8  (via drill 0.38)
  Top 0.152: IC1.P29 22.37,22.69 v23.18,21.91
  Bottom 0.152: IC3.27 25.6,22.74 24.77,21.91 v23.18,21.91
A9  (via drill 0.38)
  Top 0.152: IC1.P30 20.68,22.23 21.91,22.23 22.86,21.27 v23.81,21.27
  Bottom 0.152: v23.81,21.27 24.8,21.3 25.43,21.94 IC3.26
A10  (via drill 0.38)
  Top 0.152: IC1.P31 21.81,21.69 22.86,20.64 v23.18,20.64
  Bottom 0.152: IC3.25 25.27,21.14 24.77,20.64 v23.18,20.64
A11  (via drill 0.38)
  Top 0.152: IC1.P32 21.67,21.19 22.86,20 v23.81,20
  Bottom 0.152: IC3.24 25.1,20.34 24.77,20 v23.81,20
A12  (via drill 0.38)
  Top 0.152: v39.37,19.68 41.38,21.69 IC1.P78
  Bottom 0.152: IC3.22 39.23,19.54 v39.37,19.68
A13  (via drill 0.38)
  Top 0.152: v39.37,20.64 40.92,22.19 IC1.P79
  Bottom 0.152: IC3.21 39.07,20.34 v39.37,20.64
A14  (via drill 0.38)
  Top 0.152: v39.37,21.59 41.47,23.69 IC1.P82
  Bottom 0.152: IC3.20 38.92,21.14 v39.37,21.59
A15  (via drill 0.38)
  Top 0.152: v39.37,22.54 41.02,24.19 IC1.P83
  Bottom 0.152: IC3.19 38.77,21.94 v39.37,22.54
A16  (via drill 0.38)
  Top 0.152: v39.37,23.5 40.56,24.69 IC1.P84
  Bottom 0.152: IC3.18 38.62,22.74 v39.37,23.5
CLK_32M  (via drill 0.38)
  Top 0.152: XO1.3 5.08,21.88 v5.08,23.81 7.47,23.81 IC2.9 | IC1.P127 31.5,40.39 v31.75,40.64
  Bottom 0.152: v31.75,40.64 31.75,40.32 31.11,39.69 24.13,39.69 23.18,38.73 20.64,38.73 20.32,38.42 20.32,34.61 20,34.29 12.38,34.29 12.06,33.97 12.06,30.16 5.71,23.81 v5.08,23.81
D0  (via drill 0.38)
  Top 0.152: IC1.P98 41.97,31.69 41.91,31.75 v40.01,31.75
  Bottom 0.152: IC3.7 38.21,31.54 38.42,31.75 v40.01,31.75
D1  (via drill 0.38)
  Top 0.152: IC1.P96 41.7,30.69 41.27,31.11 v39.37,31.11
  Bottom 0.152: IC3.8 38.04,30.74 38.42,31.11 v39.37,31.11
D2  (via drill 0.38)
  Top 0.152: IC1.P93 40.34,29.19 v40.01,29.53
  Bottom 0.152: IC3.9 38.32,29.94 38.73,29.53 v40.01,29.53
D3  (via drill 0.38)
  Top 0.152: IC1.P92 39.57,28.69 v39.37,28.89
  Bottom 0.152: IC3.10 39.12,29.14 v39.37,28.89
D4  (via drill 0.38)
  Top 0.152: IC1.P91 39.3,28.19 v38.42,27.3
  Bottom 0.152: IC3.13 37.85,26.74 v38.42,27.3
D5  (via drill 0.38)
  Top 0.152: IC1.P90 39.76,27.69 v38.42,26.35
  Bottom 0.152: IC3.14 38.01,25.94 v38.42,26.35
D6  (via drill 0.38)
  Top 0.152: IC1.P88 41.61,26.69 41.27,26.35 v39.37,26.35
  Bottom 0.152: IC3.15 38.16,25.14 v39.37,26.35
D7  (via drill 0.38)
  Top 0.152: v39.37,25.4 39.69,25.72 41.27,25.72 41.75,26.19 IC1.P87
  Bottom 0.152: IC3.16 38.31,24.34 v39.37,25.4
D8  (via drill 0.38)
  Top 0.152: IC1.P25 21.66,24.69 v23.18,23.18
  Bottom 0.152: IC3.29 25.61,24.34 25.4,24.13 25.4,23.5 25.08,23.18 v23.18,23.18
D9  (via drill 0.38)
  Top 0.152: IC1.P24 22.02,25.19 v23.18,24.13
  Bottom 0.152: IC3.30 25.46,25.14 25.08,24.77 25.08,24.45 24.77,24.13 v23.18,24.13
D10  (via drill 0.38)
  Top 0.152: IC1.P21 22.84,26.69 v23.18,26.35
  Bottom 0.152: IC3.31 23.59,25.94 v23.18,26.35
D11  (via drill 0.38)
  Top 0.152: IC1.P20 22.98,27.19 v23.18,27.3
  Bottom 0.152: IC3.32 23.74,26.74 v23.18,27.3
D12  (via drill 0.38)
  Top 0.152: IC1.P15 22.7,29.69 v23.18,29.21
  Bottom 0.152: IC3.35 23.25,29.14 v23.18,29.21
D13  (via drill 0.38)
  Top 0.152: IC1.P13 22.65,30.69 v23.18,30.16
  Bottom 0.152: IC3.36 23.4,29.94 v23.18,30.16
D14  (via drill 0.38)
  Top 0.152: IC1.P12 23.1,31.19 v23.18,31.11
  Bottom 0.152: IC3.37 23.55,30.74 v23.18,31.11
D15  (via drill 0.38)
  Top 0.152: IC1.P10 23.05,32.19 v23.18,32.07
  Bottom 0.152: IC3.38 23.7,31.54 v23.18,32.07
DONE  (via drill 0.38)
  Top 0.152: IC1.P73 41.13,19.19 v40.96,19.37
  Bottom 0.152: v40.96,19.37 41.27,19.68 42.49,19.68 R20.1
FPGA_CCLK  (via drill 0.38)
  Top 0.152: IC1.P72 40.5,15.7 v40.96,15.24 | v17.14,17.78 v17.14,19.68 | v13.34,26.99 14.68,26.99 IC2.25
  Bottom 0.152: v40.96,15.24 40.96,9.53 40.64,9.21 16.51,9.21 16.19,9.53 11.11,9.53 10.79,9.21 8.89,9.21 8.57,9.53 8.57,17.46 8.89,17.78 v17.14,17.78 | v17.14,19.68 15.24,19.68 13.97,20.95 13.97,25.08 13.65,25.4 12.06,25.4 11.75,25.72 11.75,26.67 12.06,26.99 v13.34,26.99
FPGA_DIN  (via drill 0.38)
  Top 0.152: IC2.12 6.1,21.84 v6.03,21.91 | v6.03,9.84 9.84,9.84 v10.16,10.16 | v40.01,15.24 40.01,15.88 40,15.88 IC1.P71
  Bottom 0.152: v6.03,21.91 5.08,20.95 5.08,14.92 6.03,13.97 v6.03,9.84 | v10.16,10.16 39.69,10.16 40.01,10.48 v40.01,15.24
GND  (via drill 0.38)
  Top 0.152: 18.3,32.07 IC6.10 | 17.14,30.24 C13.2 | IC1.P56 32.5,18.62 v32.38,18.73 36.83,18.73 37,18.56 IC1.P65 | IC1.P100 44.12,32.69 44.13,32.7 44.53,32.7 C12.2 | 10.87,36.83 C15.2 | X7.6 X7.8 X7.10 X7.12 X7.14 X7.16 X7.18 X7.20 | IC1.P106 41.15,35.69 40.96,35.88
  Top 0.305: 22.75,28.69 IC1.P17 18.93,28.69 18.73,28.89 | IC1.P26 18.73,24.19 | IC1.P9 19.36,32.69 18.73,32.07 18.3,32.07 | IC1.P89 44.26,27.19 C2.2
  Bottom 0.152: C4.2 32.07,18.41 v32.38,18.73 34.92,18.73 | C17.2 34.92,18.73 | C10.2 37.47,18.73 34.92,18.73
  other vias: 40.32,36.51 46.04,27.94 30,37.62 29.84,34.92 33.34,25.72 44.45,6.99 44.45,2.54 24.13,6.99 24.13,2.54 1.59,5.08 10.48,5.08 5.08,13.65 19.68,12.86 22.86,15.24 2.54,23.5 9.84,29.53 13.34,30.48 10.79,35.56 18.1,36.51 11.75,40.01 6.67,46.99 26.04,37.47 44.45,34.29 43.5,37.47 47.94,42.86 29.84,30.48 43.18,46.99 18.41,23.5 23.81,22.54 25.08,19.37 25.08,28.42 33.34,30.48 15.88,29.84 7.3,13.65 18.73,33.66 16.35,26.83 10.16,11.43 17.14,20.95 8.89,20 12.06,21.27 6.67,40.01 6.67,33.02 6.03,1.59 19.37,6.99 19.37,2.54 48.9,6.99 48.9,2.54 9.53,15.56 41.59,17.14 43.5,13.34
  pour Bottom (isolate 0.152): 0,0 49.85,0 50.16,0.32 50.16,49.85 0,49.85
  pour Top (isolate 0.152): 0,0 50.16,0 50.16,49.85 0,49.85
JP0
  Top 0.152: IC1.P70 39.5,17.91 39.69,18.1 42.55,18.1 44.45,16.19 44.45,11.11 44.77,10.79 X4.2
JP1
  Top 0.152: IC1.P69 39,18.05 39.37,18.41 42.86,18.41 44.77,16.51 44.77,13.65 45.09,13.34 X4.4
JP2
  Top 0.152: IC1.P68 38.5,18.18 39.05,18.73 43.18,18.73 X4.6
JP3
  Top 0.152: IC1.P75 44.58,20.19 44.77,20 44.77,18.73 45.09,18.41 X4.8
JP4
  Top 0.152: IC1.P76 44.5,20.69 44.77,20.95 X4.10
JP5
  Top 0.152: IC1.P77 44.37,21.19 44.77,21.59 44.77,23.18 45.09,23.5 X4.12
KC_B  (via drill 0.38)
  Top 0.152: IC1.P132 29,40.53 v28.89,40.64 | v14.29,36.51 14.29,34.61 14.35,34.54 IC6.4
  Bottom 0.152: v28.89,40.64 27.3,42.23 16.83,42.23 14.29,39.69 v14.29,36.51
KC_CLK  (via drill 0.38)
  Top 0.152: IC1.P142 24,40.45 23.81,40.64 22.23,40.64 v21.91,40.32 | v17.46,35.56 17.46,34.61 17.53,34.54 IC6.9
  Bottom 0.152: v21.91,40.32 18.1,40.32 17.46,39.69 v17.46,35.56
KC_EX  (via drill 0.38)
  Top 0.152: IC1.P131 29.5,40.3 v29.84,40.64 | v13.65,35.56 13.65,34.61 13.72,34.54 IC6.3
  Bottom 0.152: v29.84,40.64 27.94,42.55 16.51,42.55 13.65,39.69 v13.65,35.56
KC_EZ  (via drill 0.38)
  Top 0.152: IC1.P130 30,39.84 v30.8,40.64 | v13.02,36.51 13.02,34.61 13.08,34.54 IC6.2
  Bottom 0.152: v30.8,40.64 28.57,42.86 16.19,42.86 13.02,39.69 v13.02,36.51
KC_G  (via drill 0.38)
  Top 0.152: IC1.P134 28,40.58 v27.94,40.64 | v14.92,35.56 14.92,34.61 14.99,34.54 IC6.5
  Bottom 0.152: v27.94,40.64 26.67,41.91 17.14,41.91 14.92,39.69 v14.92,35.56
KC_HSYNC  (via drill 0.38)
  Top 0.152: IC1.P139 25.5,40.22 25.08,40.64 v24.77,40.64 | v16.83,36.51 16.83,34.61 16.89,34.54 IC6.8
  Bottom 0.152: v24.77,40.64 24.45,40.96 18.1,40.96 16.83,39.69 v16.83,36.51
KC_R  (via drill 0.38)
  Top 0.152: IC1.P135 27.5,40.13 v26.99,40.64 | v15.56,36.51 15.56,34.61 15.62,34.54 IC6.6
  Bottom 0.152: v26.99,40.64 26.04,41.59 17.46,41.59 15.56,39.69 v15.56,36.51
KC_VSYNC  (via drill 0.38)
  Top 0.152: IC1.P138 26,40.6 v26.04,40.64 | v16.19,35.56 16.19,34.61 16.26,34.54 IC6.7
  Bottom 0.152: v26.04,40.64 25.4,41.27 17.78,41.27 16.19,39.69 v16.19,35.56
N$1  (via drill 0.38)
  Top 0.152: IC2.15 13.24,20.54 v13.02,20.32
  Top 0.508: X3.1 4.43,5.73 6.67,3.49 8.89,3.49 9.21,3.81 11.75,3.81 12.38,3.17 12.38,2.54 12.7,2.22 X2.3
  Bottom 0.152: v13.02,20.32 13.02,21.91 12.7,22.23 8.26,22.23 7.94,21.91 7.94,8.89 8.26,8.57 11.43,8.57 11.75,8.89 15.56,8.89 15.88,8.57 15.88,2.54 15.56,2.22 X2.3
N$2
  Top 0.152: IC6.18 13.72,43.75 X7.1
N$3
  Top 0.152: IC6.17 14.35,41.97 X7.3
N$4
  Top 0.152: IC6.16 14.99,41.97 15.88,42.86 17.78,42.86 X7.5
N$5
  Top 0.152: IC6.15 15.62,41.97 16.19,42.55 20,42.55 X7.7
N$6
  Top 0.152: IC6.14 16.26,41.97 16.51,42.23 22.23,42.23 X7.9
N$7
  Top 0.152: IC6.13 16.89,41.66 17.14,41.91 24.45,41.91 X7.11
N$8
  Top 0.152: IC6.12 17.53,41.34 17.78,41.59 26.67,41.59 X7.13
N$9
  Top 0.152: IC6.11 18.16,41.02 18.41,41.27 28.89,41.27 X7.15
N$10
  Top 0.152: R16.2 42.86,0.95 42.55,0.64 34.29,0.64 33.97,0.95 33.97,2.21 X1.13
N$11  (via drill 0.38)
  Top 0.152: R1.1 1.59,13.65 1.91,13.97 2.54,13.97 2.86,14.29 2.86,17.78 4.13,19.05 8.89,19.05 9.53,19.68 9.53,22.54 v9.21,22.86 | v12.7,23.18 12.38,23.5 12.38,24.77 12.71,25.09 IC2.22
  Bottom 0.152: v9.21,22.86 9.53,23.18 v12.7,23.18
N$12  (via drill 0.38)
  Top 0.152: R2.1 2.33,15.03 2.54,15.24 2.54,18.1 3.81,19.37 6.67,19.37 v6.99,19.68 | IC2.21 13.33,24.44 v13.02,24.45
  Bottom 0.152: v13.02,24.45 12.7,24.13 8.57,24.13 6.99,22.54 v6.99,19.68
N$13
  Top 0.152: X3.2 5.23,9.69 5.08,9.84 1.91,9.84 1.59,10.16 R1.2
N$14  (via drill 0.38)
  Top 0.152: X3.3 6.03,5.71 v6.67,5.08 | 1.59,17.78 v1.59,18.1 R2.2
  Bottom 0.152: v6.67,5.08 5.71,5.08 1.59,9.21 v1.59,18.1
N$15
  Top 0.152: R15.2 22.23,8.89 22.54,8.57 26.04,8.57 26.35,8.26 26.35,0.95 26.67,0.64 31.43,0.64 31.68,0.88 X1.14
N$16
  Top 0.305: IC2.20 16.72,23.79 C24.1
N$17
  Top 0.152: R14.2 R13.2 R12.2 R11.2 28.57,9.21 28.89,8.89 33.66,8.89 33.97,8.57 33.97,7.31 X1.3
N$18
  Top 0.152: R10.2 R9.2 R8.2 R7.2 34.92,8.63 X1.2
N$19
  Top 0.152: R3.2 R4.2 R5.2 R6.2 36.51,9.32 X1.1
N$20
  Bottom 0.813: X7.4 X7.2 8.57,46.35 7.94,45.72 7.94,28.57 3.81,24.45 3.81,8.89 5.4,7.3 X2.1
N$21  (via drill 0.38)
  Top 0.152: LED2.A 42.11,16.08 v42.55,16.51
  Bottom 0.152: R20.2 43.6,21.17 43.81,20.95 43.81,17.78 v42.55,16.51
N$22  (via drill 0.38)
  Top 0.152: IC2.26 13.59,27.69 11.43,29.84 v11.43,31.75 | v9.53,38.73 8.36,38.73 R21.1
  Bottom 0.152: v11.43,31.75 11.43,38.42 11.11,38.73 v9.53,38.73
N$23
  Top 0.152: LED1.A 8.46,36.73 R21.2
PMD0
  Top 0.152: IC1.P43 26.04,16.8 26.04,14.29 25.4,13.65 21.59,13.65 19.68,15.56 11.11,15.56 10.79,15.88 10.79,26.67 10.53,27.04 IC2.4 5.98,27.04 5.71,27.3 5.71,31.43 5.4,31.75 X6.4
PMD1
  Top 0.152: IC1.P44 26.5,14.12 25.72,13.34 21.27,13.34 19.37,15.24 10.79,15.24 10.48,15.56 10.48,26.04 10.12,26.39 IC2.5 5.36,26.39 5.08,26.67 5.08,28.89 4.76,29.21 X6.5
PMD2
  Top 0.152: IC1.P45 27,13.98 26.04,13.02 20.95,13.02 19.05,14.92 10.48,14.92 10.16,15.24 10.16,25.4 9.82,25.74 IC2.6
PMD3
  Top 0.152: IC2.18 17.41,22.49 17.78,22.86 18.73,22.86 19.56,23.69 IC1.P27
PMD4
  Top 0.152: IC1.P28 19.7,23.19 19.05,22.54 18.1,22.54 17.39,21.84 IC2.17
PMD5  (via drill 0.38)
  Top 0.152: IC2.16 13.42,21.19 11.75,22.86 11.75,27.62 v12.06,27.94 | IC1.P18 19.3,28.19 v19.05,27.94
  Bottom 0.152: v12.06,27.94 v19.05,27.94
PMD6
  Top 0.152: IC1.P42 25.5,14.39 25.08,13.97 21.91,13.97 20,15.88 11.43,15.88 11.11,16.19 11.11,27.3 10.73,27.69 IC2.3
PMD7
  Top 0.152: IC2.2 11.03,28.34 11.43,27.94 11.43,16.51 11.75,16.19 20.32,16.19 22.23,14.29 24.77,14.29 25.08,14.61 25.08,15.56 25,15.64 IC1.P41
TCK  (via drill 0.38)
  Top 0.152: v42.55,39.05 40.96,39.05 40.95,39.04 IC1.P109
  Bottom 0.152: X5.3 42.86,31.75 42.55,32.07 v42.55,39.05
TDI
  Top 0.152: IC1.P2 21.9,36.19 22.54,36.83 24.13,36.83 25.4,35.56 36.51,35.56 38.1,37.15 41.27,37.15 41.59,37.47 41.59,37.78 41.91,38.1 43.18,38.1 43.5,38.42 43.5,39.37 43.81,39.69 45.4,39.69 45.72,39.37 45.72,38.73 X5.5
TDO
  Top 0.152: IC1.P107 43.81,36.19 43.81,36.2 44.45,35.56 46.68,35.55 X5.4
TMS  (via drill 0.38)
  Top 0.152: IC1.P1 21.77,36.69 22.23,37.15 24.45,37.15 25.72,35.88 36.2,35.88 37.78,37.47 40.96,37.47 41.27,37.78 41.27,38.1 41.59,38.42 42.86,38.42 43.18,38.73 43.18,39.69 43.5,40.01 45.4,40.01 v45.72,40.32 | v45.4,34.29 45.72,33.97 45.72,31.11 X5.2
  Bottom 0.152: v45.72,40.32 45.72,34.61 v45.4,34.29
VCCINT  (via drill 0.38)
  Top 0.152: 34,40.61 v33.97,40.64 | 44.68,29.69 C2.1 | 30.82,14.9 v30.82,14.87
  Top 0.254: IC1.P52 30.48,16.84
  Top 0.305: IC1.P122 34,40.61 | 44.68,29.69 IC1.P94 40.8,29.69 40.16,30.32 35.4,30.32 | v30.82,14.87 30.5,15.18 IC1.P52 30.5,25.38 30.48,25.4 | v19.05,26.04 19.21,26.19 IC1.P22 22.07,26.19 22.86,25.4 30.48,25.4 | 35.4,30.32 30.48,25.4 | 35.4,30.32 35.4,33.18 v33.97,34.61 | IC4.4 6.33,17.75 6.03,17.46 6.03,14.92 6.35,14.61 v9.53,14.61
  Bottom 0.152: 33.97,38.81 C1.1 | 15.15,13.56 15.24,13.65 | R22.2 19.79,13.76 19.68,13.65
  Bottom 0.305: v33.97,40.64 33.97,38.81 | v33.97,34.61 33.97,38.66 C1.1 | v9.53,14.61 10.48,13.65 15.24,13.65 19.68,13.65 29.61,13.65 v30.82,14.87 30.88,14.92 31.75,14.92 32.07,15.24 C4.1 | C25.1 15.15,13.56 | C3.1 18.41,26.67 v19.05,26.04
VGA_B0
  Top 0.152: IC1.P46 27.5,13.85 26.35,12.7 24.13,12.7 23.81,12.38 R14.1
VGA_B1
  Top 0.152: IC1.P47 28,13.71 26.67,12.38 25.72,12.38 25.4,12.06 R13.1
VGA_B2
  Top 0.152: IC1.P48 28.5,13.58 26.99,12.06 26.77,12.06 R12.1
VGA_B3
  Top 0.152: IC1.P49 29,12.81 28.57,12.38 R11.1
VGA_G0
  Top 0.152: IC1.P50 29.5,14 30.16,13.34 R10.1
VGA_G1
  Top 0.152: IC1.P51 30,14.45 31.75,12.7 R9.1
VGA_G2
  Top 0.152: IC1.P54 31.5,14.54 33.34,12.7 R8.1
VGA_G3
  Top 0.152: IC1.P55 32,14.67 33.66,13.02 34.61,13.02 34.92,12.7 R7.1
VGA_HSYNC
  Top 0.152: IC1.P64 36.5,15.89 36.83,15.56 36.83,14.92 37.15,14.61 42.55,14.61 42.86,14.29 R16.1
VGA_R0
  Top 0.152: IC1.P57 33,14.31 33.97,13.34 36.2,13.34 36.51,13.02 R6.1
VGA_R1
  Top 0.152: IC1.P58 33.5,14.44 34.29,13.65 37.78,13.65 38.1,13.34 R5.1
VGA_R2
  Top 0.152: IC1.P59 34,14.58 34.61,13.97 39.37,13.97 39.69,13.65 R4.1
VGA_R3
  Top 0.152: R3.1 41.27,13.97 40.96,14.29 34.92,14.29 34.5,14.71 IC1.P60
VGA_VSYNC  (via drill 0.38)
  Top 0.152: R15.1 21.06,11.64 v20.95,11.75 | IC1.P62 35.5,15.62 v36.2,14.92
  Bottom 0.152: v20.95,11.75 35.88,11.75 36.2,12.06 v36.2,14.92

### Text on the board
Top: top
Bottom: thoralt@googlemail.com | KCVGA v1.1 | bot